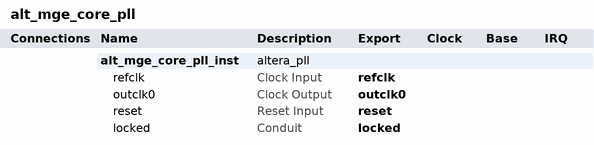
[diagram p0: system contents]
# Platform Designer (Qsys) system alt_mge_core_pll, Arria V Unknown
# Parameters at their usual value, and those the tool derives, are not listed.
package require -exact qsys 14.1
create_system alt_mge_core_pll
set_project_property DEVICE_FAMILY {Arria V}
set_project_property DEVICE Unknown

add_instance alt_mge_core_pll_inst altera_pll 14.1
set_instance_property alt_mge_core_pll_inst AUTO_EXPORT true
set_instance_parameter_value alt_mge_core_pll_inst gui_device_speed_grade 3_H3
set_instance_parameter_value alt_mge_core_pll_inst gui_number_of_clocks 1
set_instance_parameter_value alt_mge_core_pll_inst gui_operation_mode direct
set_instance_parameter_value alt_mge_core_pll_inst gui_output_clock_frequency0 156.25
set_instance_parameter_value alt_mge_core_pll_inst gui_pll_mode {Integer-N PLL}
set_instance_parameter_value alt_mge_core_pll_inst gui_reference_clock_frequency 125.0
set_instance_parameter_value alt_mge_core_pll_inst gui_use_locked true

# exported interfaces
add_interface locked conduit end
set_interface_property locked EXPORT_OF alt_mge_core_pll_inst.locked
add_interface outclk0 clock source
set_interface_property outclk0 EXPORT_OF alt_mge_core_pll_inst.outclk0
add_interface refclk clock sink
set_interface_property refclk EXPORT_OF alt_mge_core_pll_inst.refclk
add_interface reset reset sink
set_interface_property reset EXPORT_OF alt_mge_core_pll_inst.reset

set_interconnect_requirement {$system} qsys_mm.clockCrossingAdapter HANDSHAKE
set_interconnect_requirement {$system} qsys_mm.insertDefaultSlave FALSE
set_interconnect_requirement {$system} qsys_mm.maxAdditionalLatency 1

save_system alt_mge_core_pll.qsys
